# Altium schematic sheet [3]_ENC28J60.SchDoc
size A4
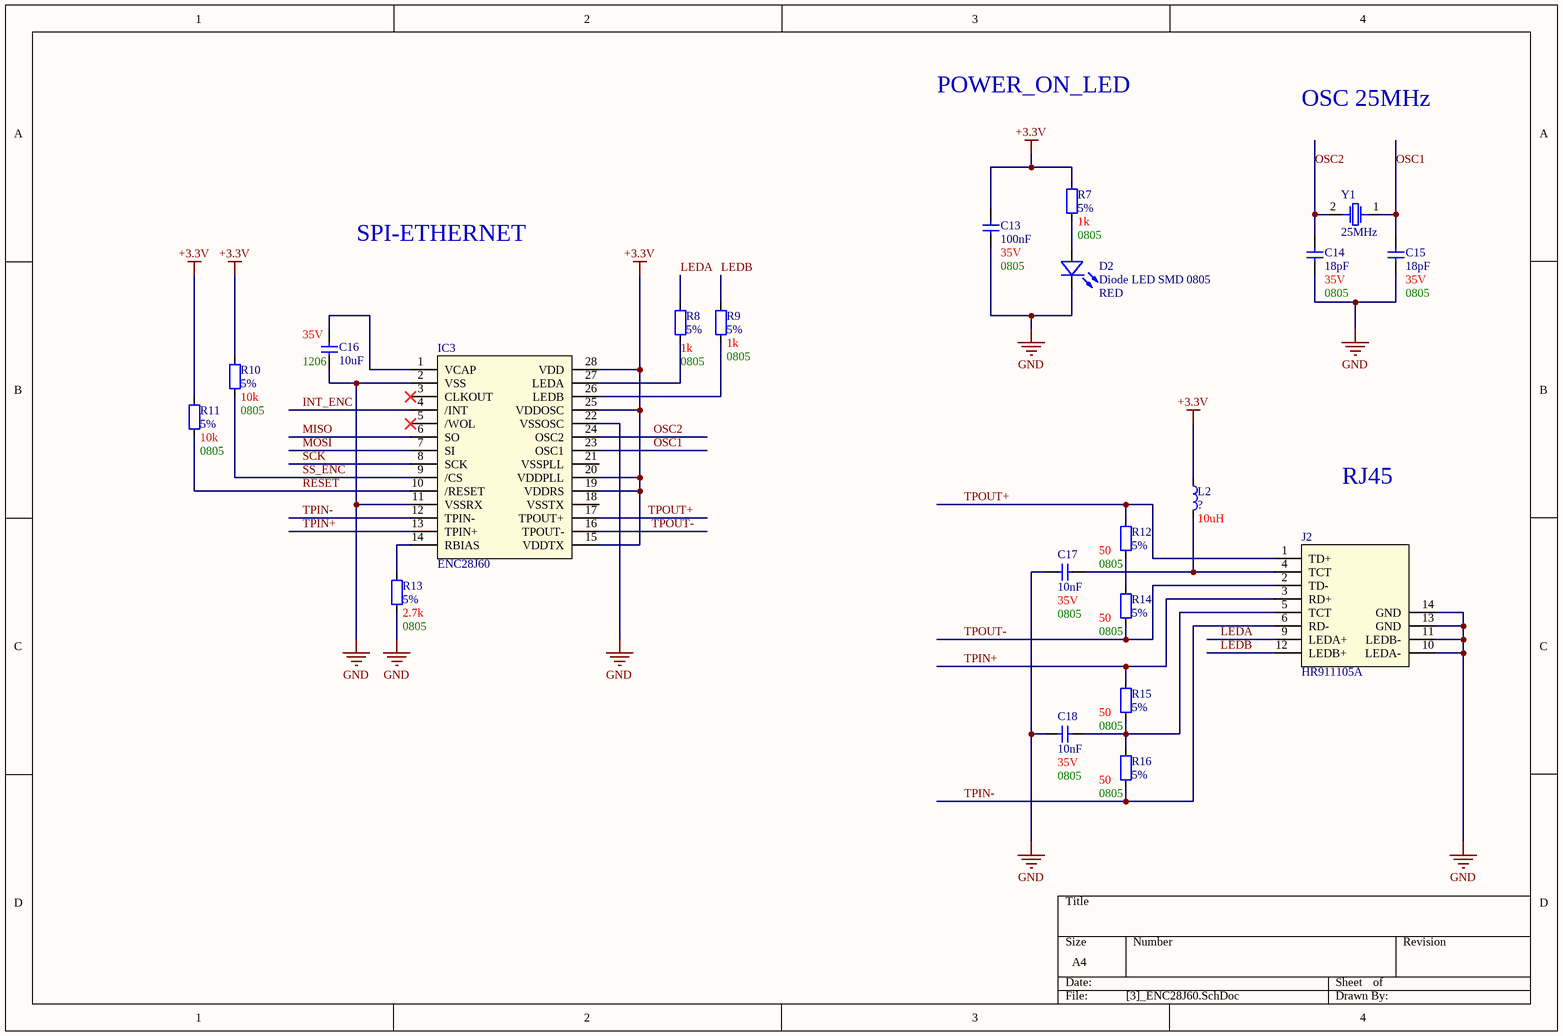
[diagram p0: [3]_ENC28J60.SchDoc]

## Parts
C13  value 100nF  Voltage: 35V  Package: 0805  [Capacitor_0805]  (hidden comment: Capacitor SMD 0805)
C14  value 18pF  Voltage: 35V  Package: 0805  [Capacitor_0805]  (hidden comment: Capacitor SMD 0805)
C15  value 18pF  Voltage: 35V  Package: 0805  [Capacitor_0805]  (hidden comment: Capacitor SMD 0805)
C16  value 10uF  Voltage: 35V  Package: 1206  [CAP_SMD_1206]  (hidden comment: Capacitor SMD 1206)
C17  value 10nF  Voltage: 35V  Package: 0805  [Capacitor_0805]  (hidden comment: Capacitor SMD 0805)
C18  value 10nF  Voltage: 35V  Package: 0805  [Capacitor_0805]  (hidden comment: Capacitor SMD 0805)
D2  Diode LED SMD 0805  Colour: RED  [Diode_LED_SMD_0805]
IC3  ENC28J60  [SO-28W]
J2  HR911105A  [HR911105A]
L2  ?  value 10uH  [IND_IHLP2525]
R7  Tolerance: 5%  Package: 0805  [R_0805]  (hidden comment: 1k)
R8  Tolerance: 5%  Package: 0805  [R_0805]  (hidden comment: 1k)
R9  Tolerance: 5%  Package: 0805  [R_0805]  (hidden comment: 1k)
R10  Tolerance: 5%  Package: 0805  [R_0805]  (hidden comment: 10k)
R11  Tolerance: 5%  Package: 0805  [R_0805]  (hidden comment: 10k)
R12  Tolerance: 5%  Package: 0805  [R_0805]  (hidden comment: 50)
R13  Tolerance: 5%  Package: 0805  [R_0805]  (hidden comment: 2.7k)
R14  Tolerance: 5%  Package: 0805  [R_0805]  (hidden comment: 50)
R15  Tolerance: 5%  Package: 0805  [R_0805]  (hidden comment: 50)
R16  Tolerance: 5%  Package: 0805  [R_0805]  (hidden comment: 50)
Y1  value 25MHz  [HC49SM]  (hidden comment: HC49SM)

## Nets
+3.3V: C13.2 IC3.15(VDDTX) IC3.19(VDDRS) IC3.20(VDDPLL) IC3.25(VDDOSC) IC3.28(VDD) L2.1 R7.2 R10.2 R11.1
GND: C13.1 C14.2 C15.2 C16.1 C17.1 C18.1 D2.C IC3.2(VSS) IC3.11(VSSRX) IC3.22(VSSOSC) J2.10(LEDA-) J2.11(LEDB-) J2.13(GND) J2.14(GND) R13.1
INT_ENC: IC3.4(/INT)
LEDA: J2.9(LEDA+) R8.2
LEDB: J2.12(LEDB+) R9.2
MISO: IC3.6(SO)
MOSI: IC3.7(SI)
OSC1: C15.1 IC3.23(OSC1) Y1.1
OSC2: C14.1 IC3.24(OSC2) Y1.2
RESET: IC3.10(/RESET) R11.2
SCK: IC3.8(SCK)
SS_ENC: IC3.9(/CS) R10.1
TPIN+: IC3.13(TPIN+) J2.3(RD+) R15.2
TPIN-: IC3.12(TPIN-) J2.6(RD-) R16.1
TPOUT+: IC3.17(TPOUT+) J2.1(TD+) R12.2
TPOUT-: IC3.16(TPOUT-) J2.2(TD-) R14.1
NetC16_2: C16.2 IC3.1(VCAP)
NetC17_2: C17.2 J2.4(TCT) L2.2
NetC18_2: C18.2 J2.5(TCT) R15.1 R16.2
NetD2_A: D2.A R7.1
NetIC3_14: IC3.14(RBIAS) R13.2
NetIC3_26: IC3.26(LEDB) R9.1
NetIC3_27: IC3.27(LEDA) R8.1
NetR12_1: R12.1 R14.2

Not connected (* = marked no-connect by the designer): IC3 3(CLKOUT)* 5(/WOL)* 18(VSSTX) 21(VSSPLL)

## Notes on the sheet
- Labels drawn without touching a wire or pin: OSC 25MHz, POWER_ON_LED, RJ45, SPI-ETHERNET

## Library data of the parts
C13-C15 C17 C18 = Capacitor SMD 0805: Ceramic Capacitor SMD 0805; Tolerance: 10%
C16 = Capacitor SMD 1206: Ceramic Capacitor SMD 1206; Tolerance: 10%
IC3 = ENC28J60: ENC28J60 - Stand-Alone Ethernet Controller  with SPI Interface
J2 = HR911105A: HR911105A - Ethernet connector RJ45
L2 = IHLP2525CZER150M01: Power Inductor IHLP2525 Series
R7-R16 = Resistor SMD 0805
  R7-R9: Value: 1k
  R10 R11: Value: 10k
  R12 R14-R16: Value: 50
  R13: Value: 2.7k
Y1 = HC49SM: HC49SM - Crystal oscilator